# EasyEDA schematic 平衡车5.0.1.json

## Sheets
1 spin27: TITLE: Sheet_1; REV: 1.0; Date: 2022-07-06; Sheet: 1/1; Drawn By: Uchiha-Leslie; Company: Your Company
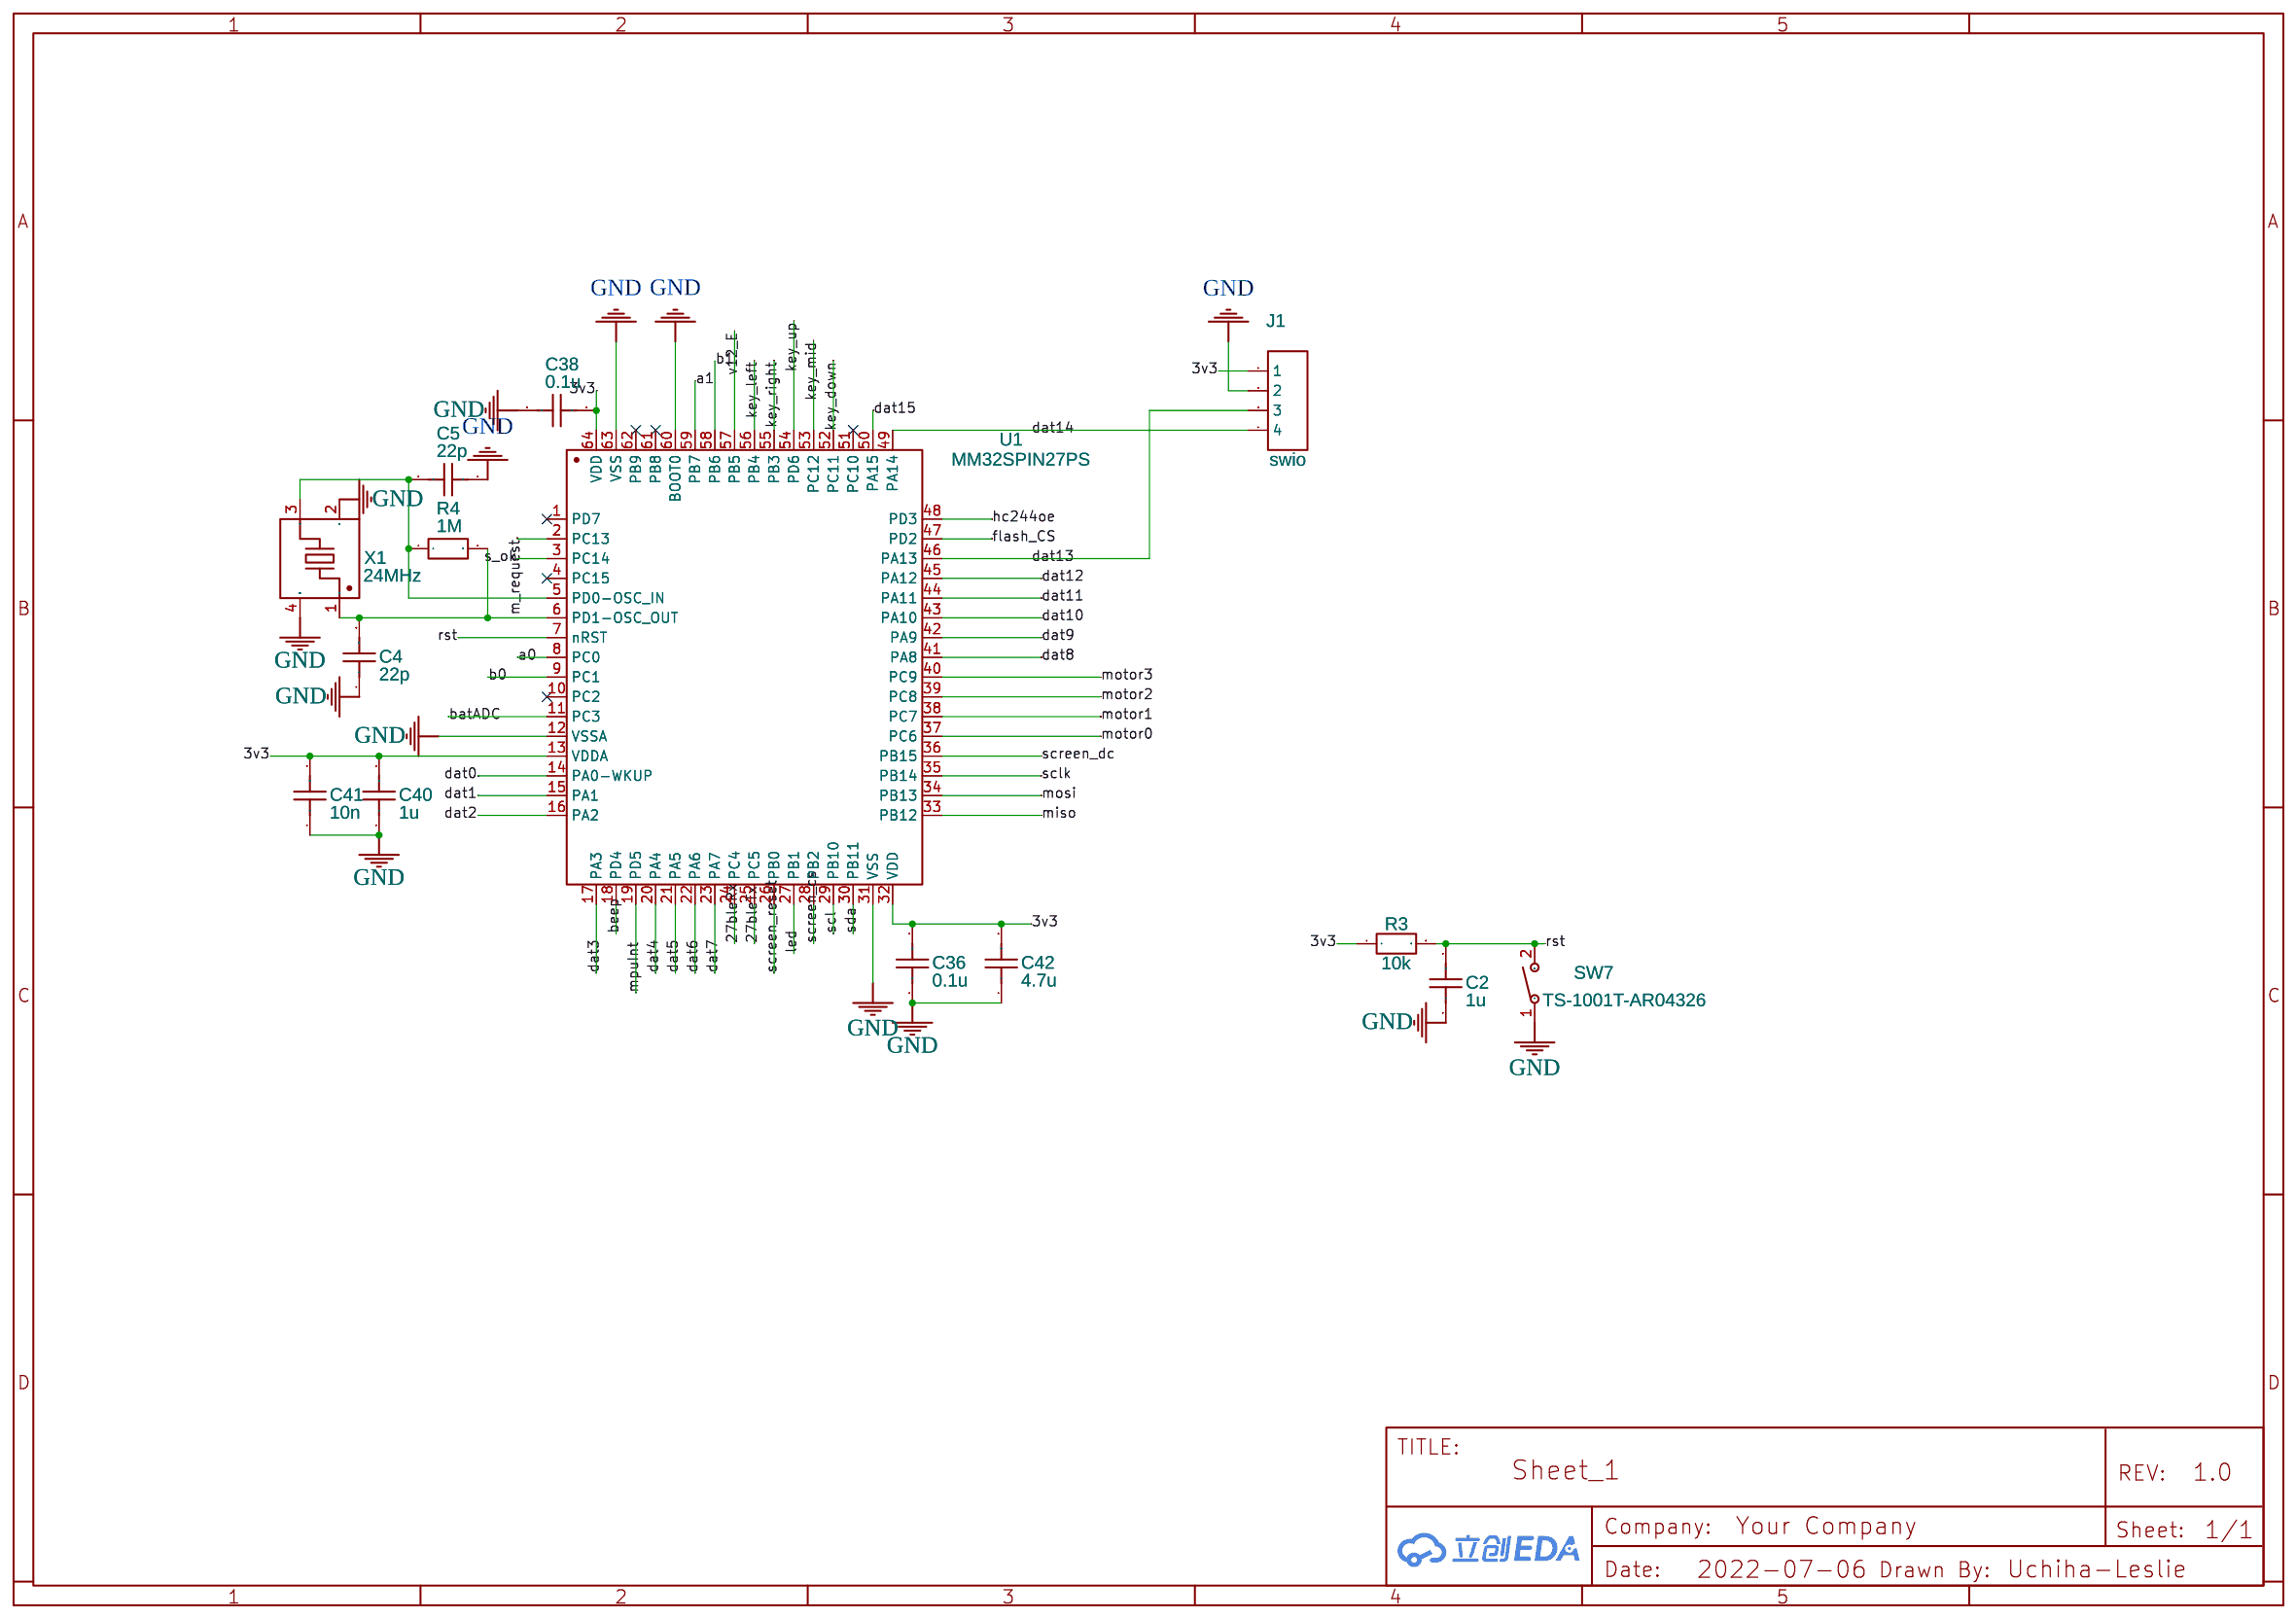
[diagram p0: spin27]
2 其他外设
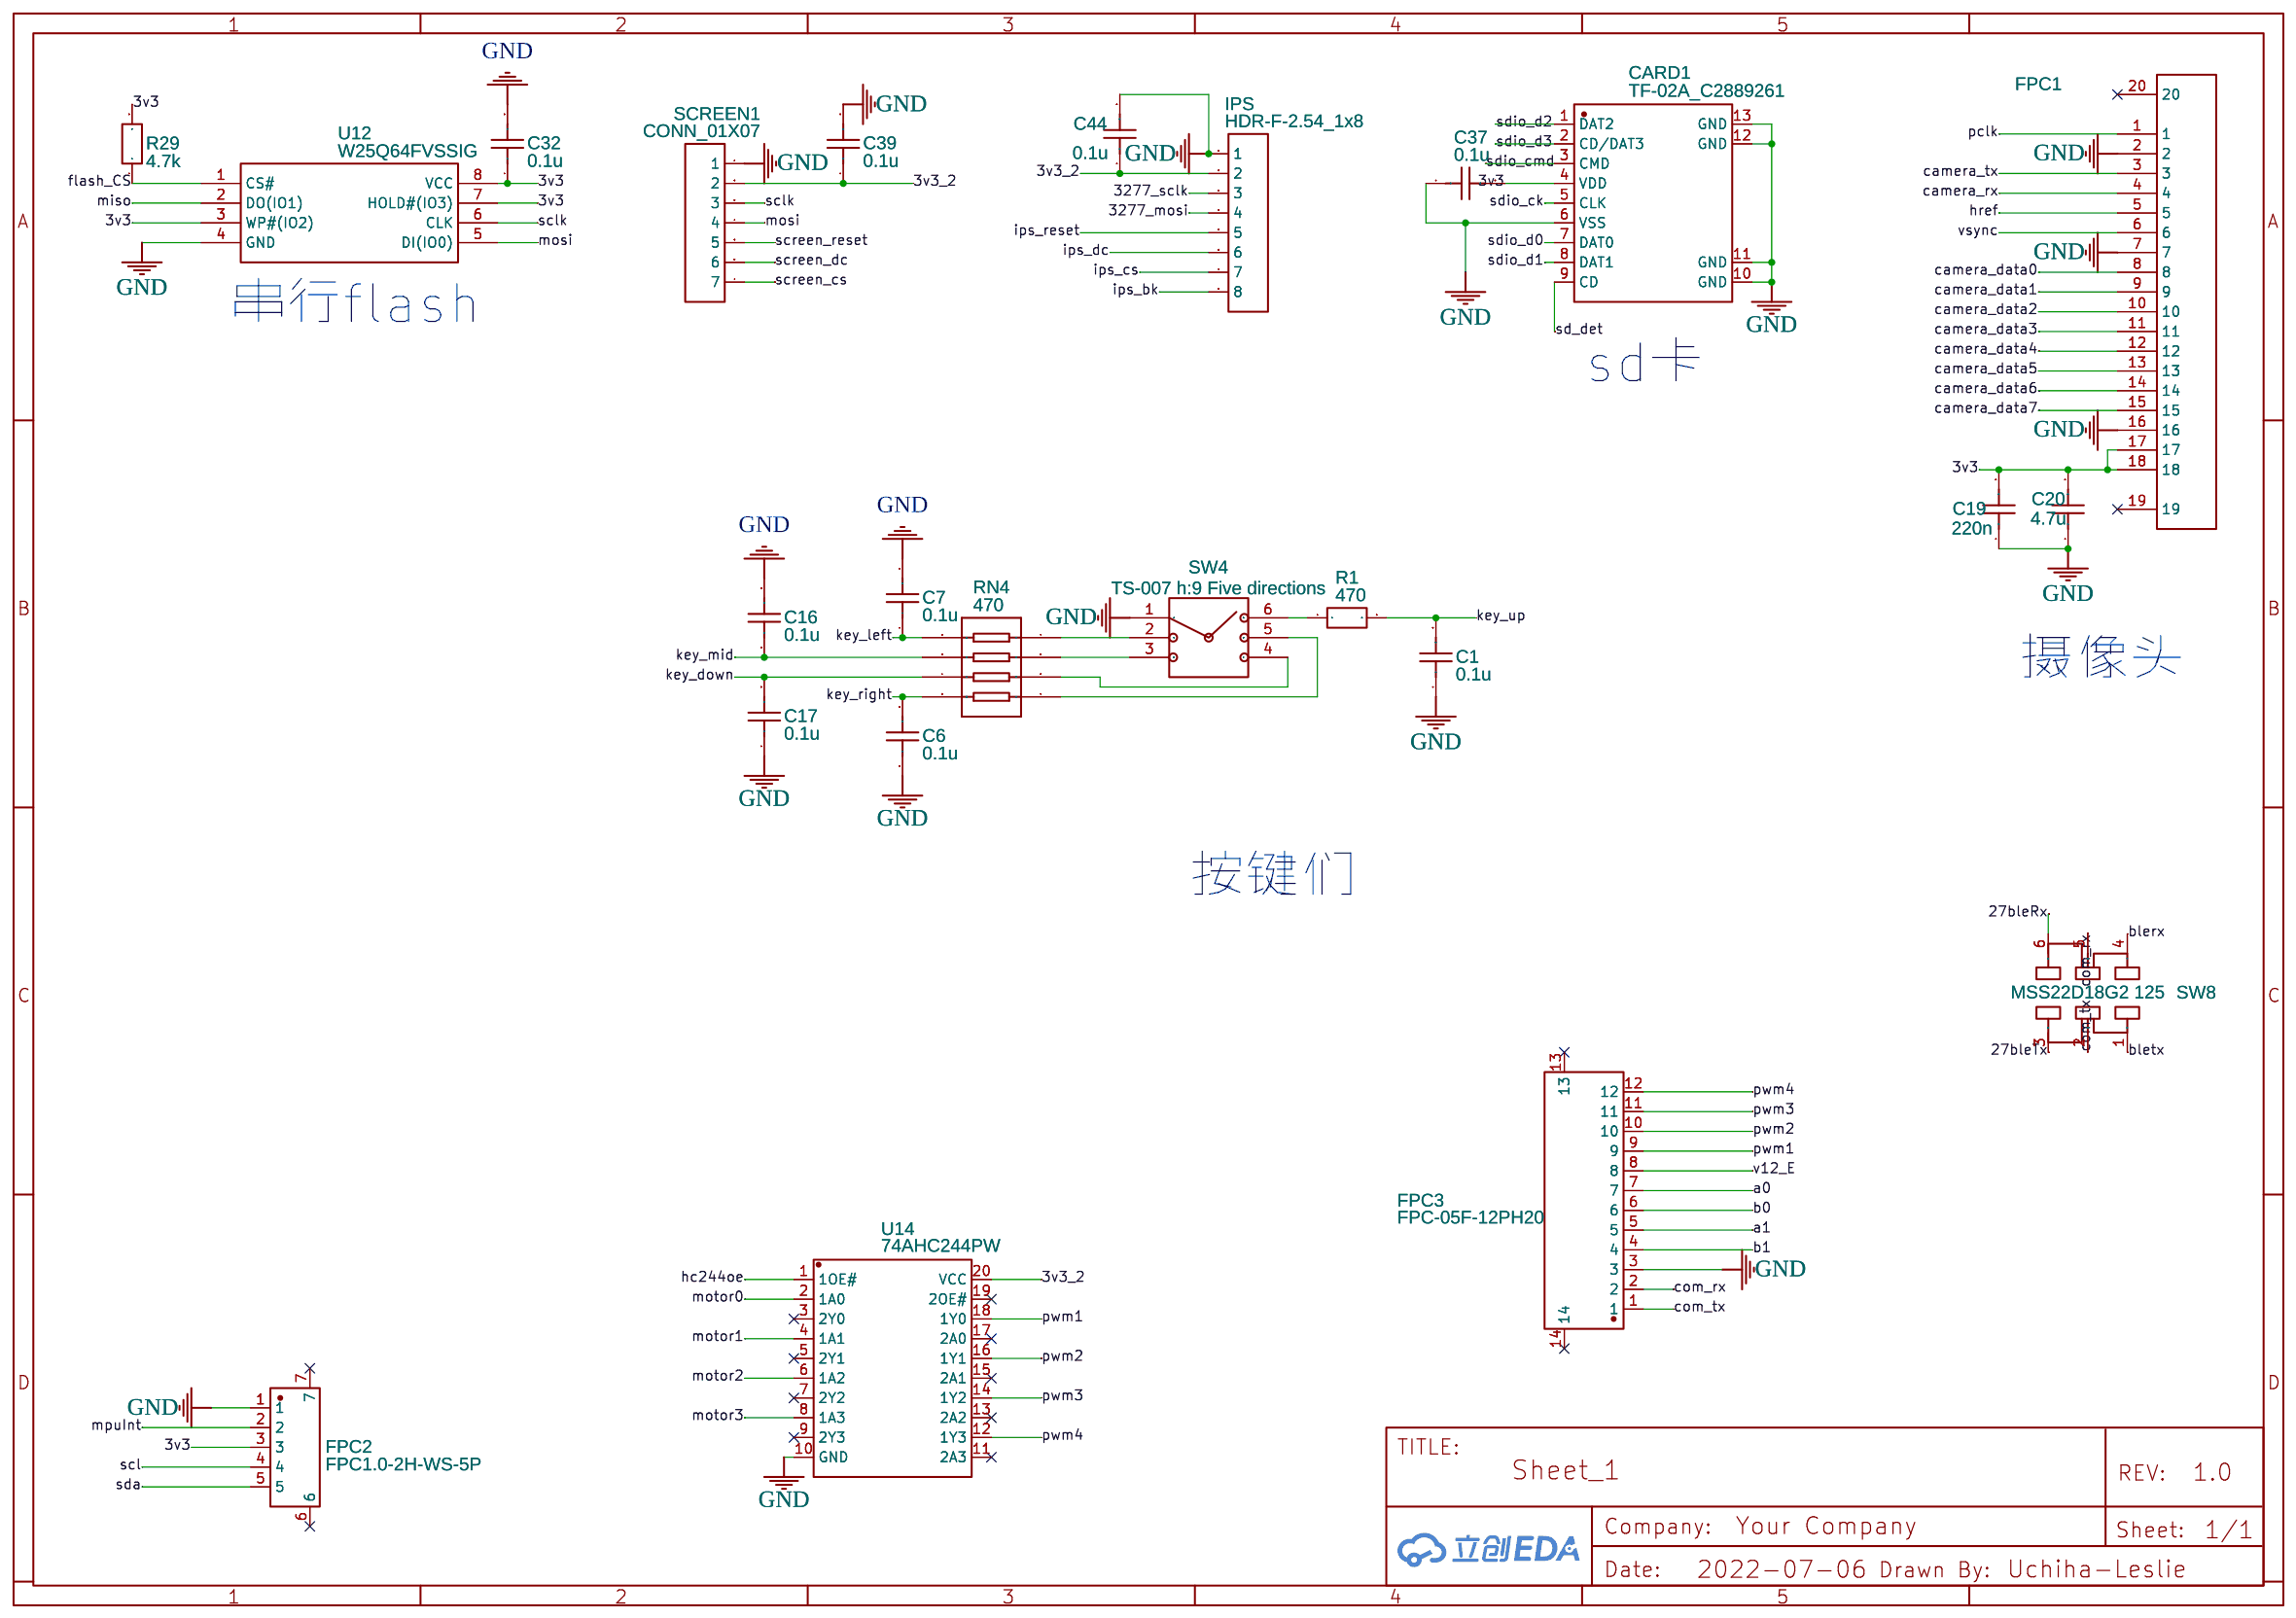
[diagram p1: 其他外设]
3 3277: TITLE: Sheet_2; Date: 2022-07-07
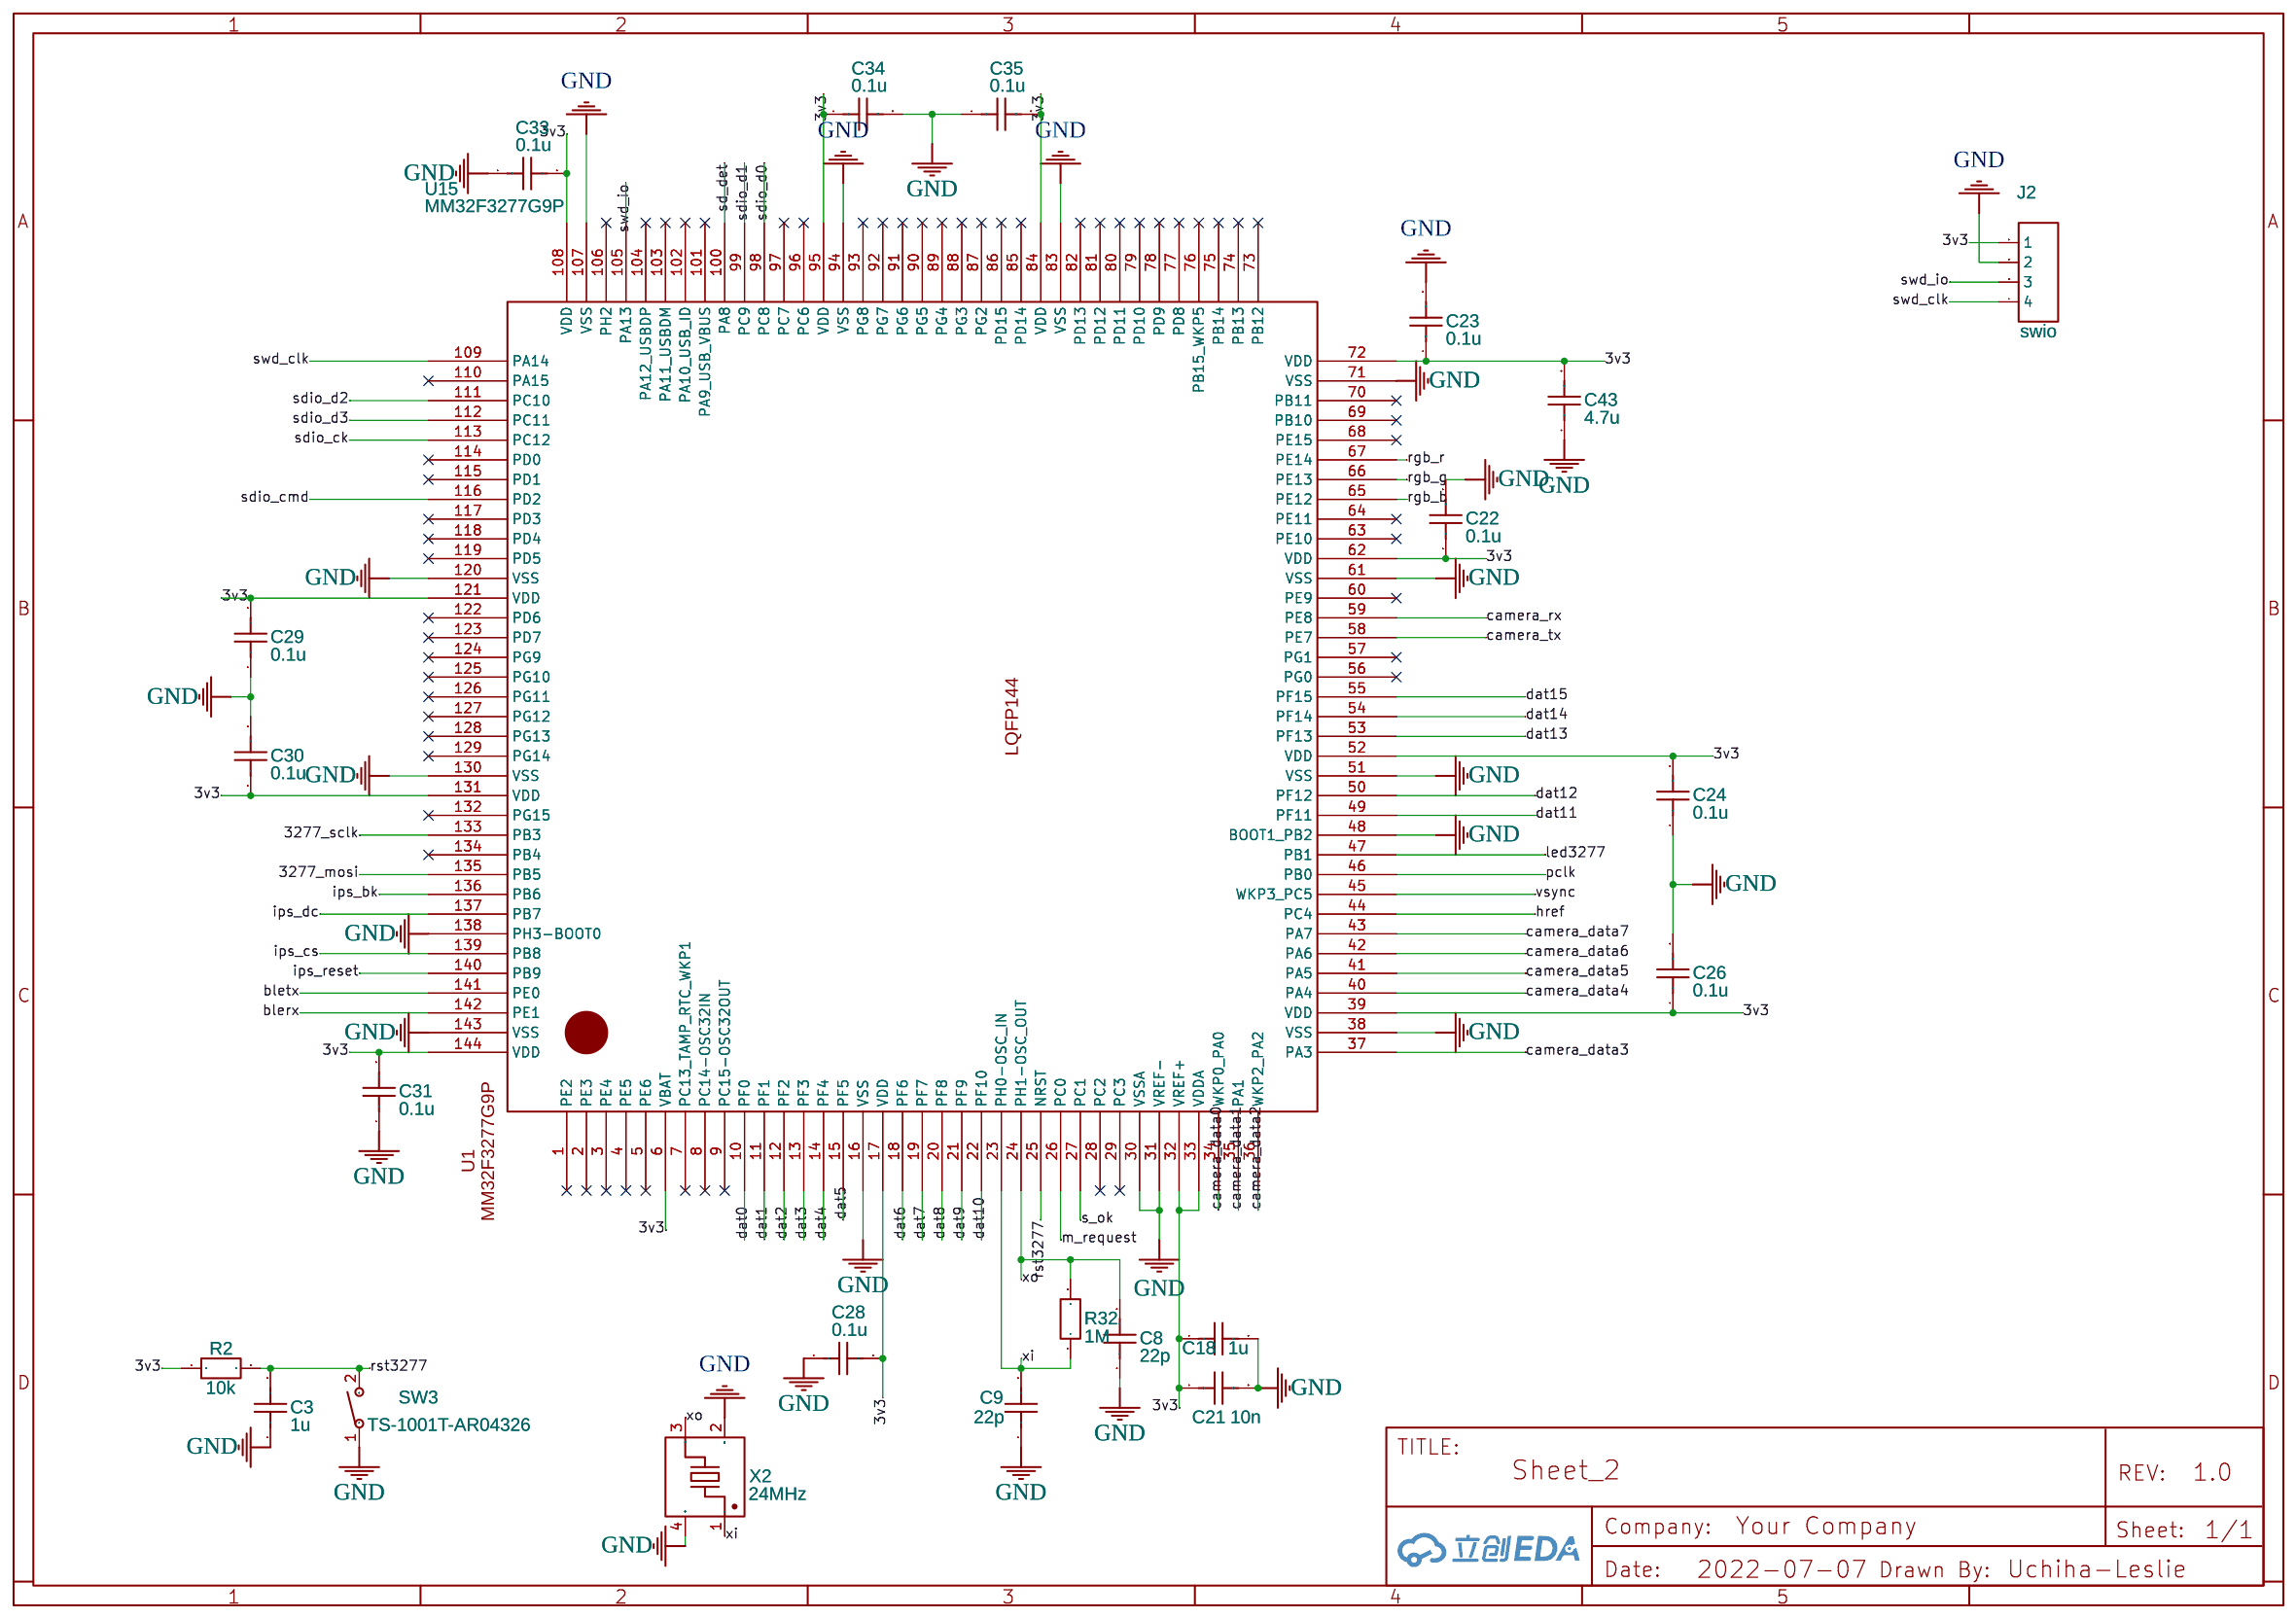
[diagram p2: 3277]
4 电源、稳压与测量: TITLE: Sheet_2; Date: 2022-07-29
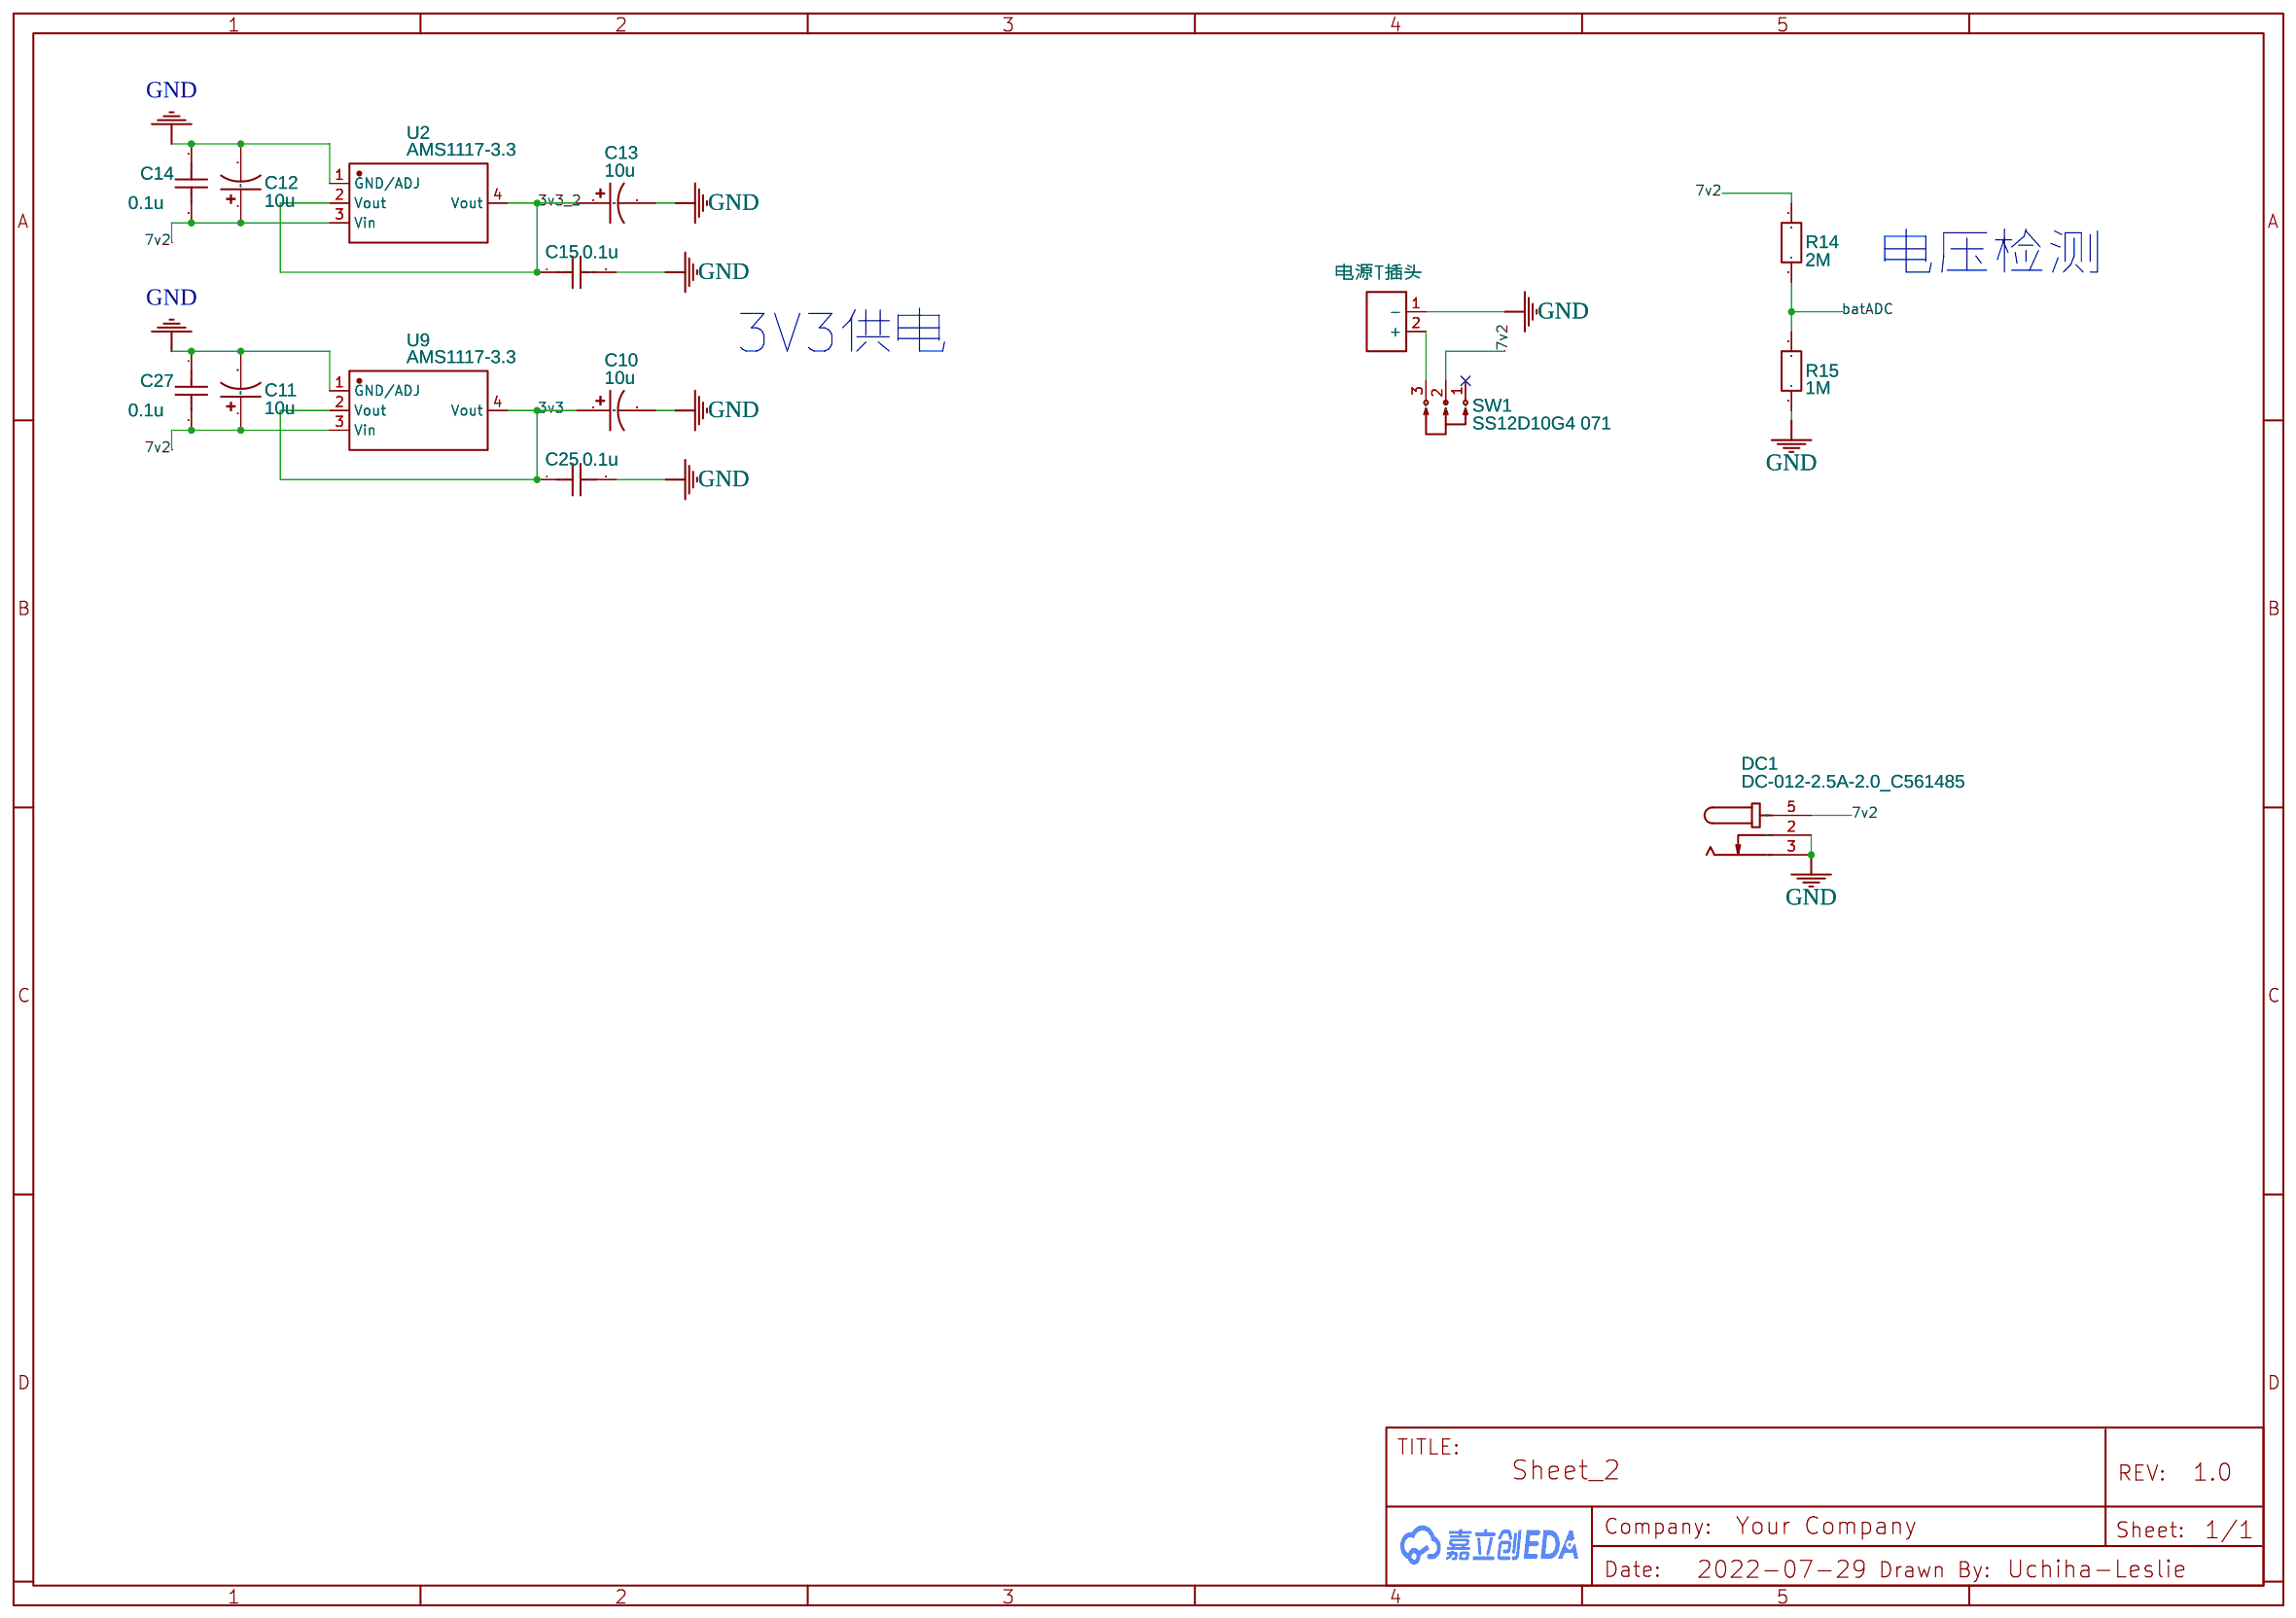
[diagram p3: 电源、稳压与测量]
5 蜂鸣器与LED: TITLE: Sheet_2; Date: 2022-07-29
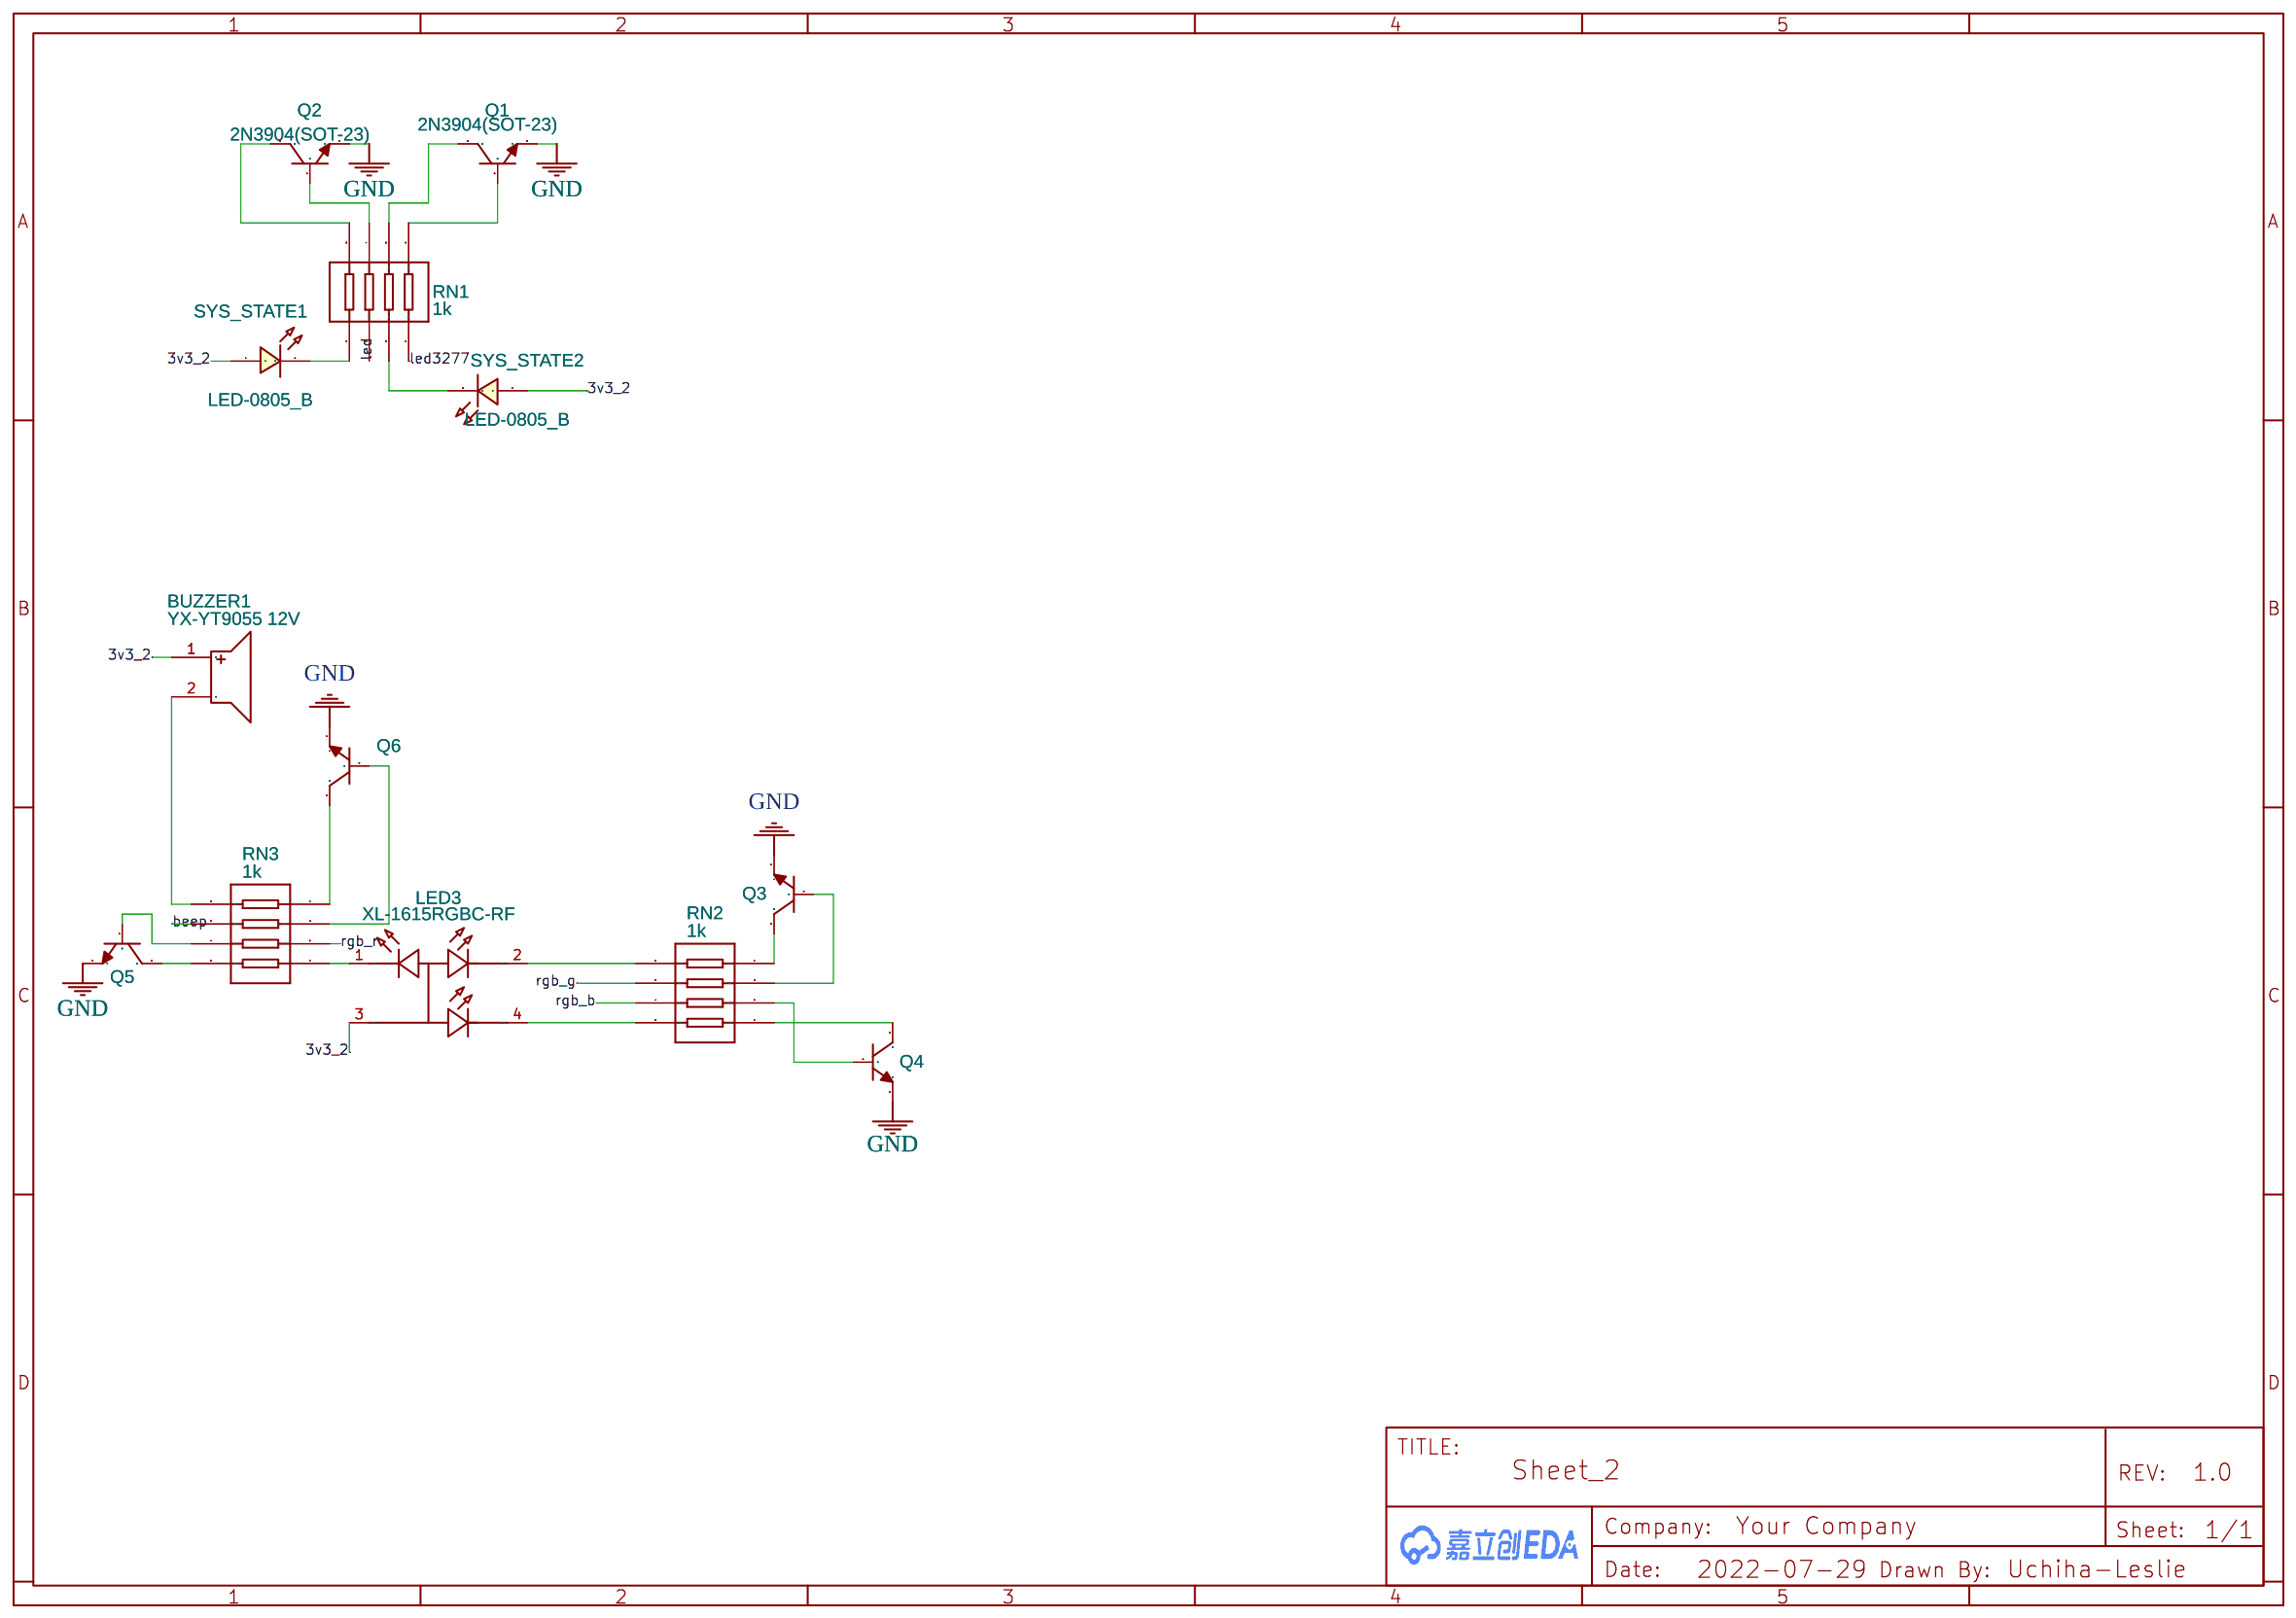
[diagram p4: 蜂鸣器与LED]

## Parts
sheet 3277
C3  1u  [C0603]
C8  22p  [C0603]
C9  22p  [C0603]
C18  1u  [C0603]
C21  10n  [C0603]
C22  0.1u  [C0402]
C23  0.1u  [C0402]
C24  0.1u  [C0402]
C26  0.1u  [C0402]
C28  0.1u  [C0402]
C29  0.1u  [C0402]
C30  0.1u  [C0402]
C31  0.1u  [C0402]
C33  0.1u  [C0402]
C34  0.1u  [C0402]
C35  0.1u  [C0402]
C43  4.7u  [C0603]
J2  swio  [HDR-M-2.54_1X4]
R2  10k  [R0603]
R32  1M  [R0603]
SW3  TS-1001T-AR04326  [KEY-SMD_L6.0-W3.5-LS8.0]
U15  MM32F3277G9P  [MM32F3277G9P]
X2  24MHz  [CRYSTAL-SMD_4P-L2.0-W1.6-BL-2]
sheet spin27
C2  1u  [C0603]
C4  22p  [C0603]
C5  22p  [C0603]
C36  0.1u  [C0402]
C38  0.1u  [C0402]
C40  1u  [C0603]
C41  10n  [C0603]
C42  4.7u  [C0603]
J1  swio  [HDR-M-2.54_1X4]
R3  10k  [R0603]
R4  1M  [R0603]
SW7  TS-1001T-AR04326  [KEY-SMD_L6.0-W3.5-LS8.0]
U1  MM32SPIN27PS  [LQFP-64_L10.0-W10.0-P0.50-LS12.0-BL]
X1  24MHz  [CRYSTAL-SMD_4P-L2.0-W1.6-BL-2]
sheet 其他外设
C1  0.1u  [C0402]
C6  0.1u  [C0402]
C7  0.1u  [C0402]
C16  0.1u  [C0402]
C17  0.1u  [C0402]
C19  220n  [C0603]
C20  4.7u  [C0603]
C32  0.1u  [C0402]
C37  0.1u  [C0402]
C39  0.1u  [C0402]
C44  0.1u  [C0402]
CARD1  TF-02A_C2889261  [TF-SMD_TF-02]
FPC1  F0500WR-S-18PNLNG1GB0R  [FPC-SMD_18P-P0.50_F0500WR-S-18PNLNG1GB0R]
FPC2  FPC1.0-2H-WS-5P  [FPC-SMD_5P-P1.00_FPC1.0-2H-WS-5P]
FPC3  FPC-05F-12PH20  [FPC-SMD_12P-P0.50_FPC-05F-12PH20]
IPS  HDR-F-2.54_1x8  [HDR-F-2.54_1X8]
R1  470  [R0603]
R29  4.7k  [R0603]
RN4  470  [RES-ARRAY-SMD_0603-8P-L3.2-W1.6-BL]
SCREEN1  CONN_01X07  [HDR-M-2.54_1X7]
SW4  TS-007 h:9 Five directions  [KEY-SMD_TS-007]
SW8  MSS22D18G2 125  [SW-TH_SHOU_MSS22D18G2]
U12  W25Q64FVSSIG  [SOP-8_L5.3-W5.2-P1.27-LS7.9-BL]
U14  74AHC244PW  [TSSOP-20_L6.5-W4.4-P0.65-LS6.4-BL]
sheet 电源、稳压与测量
C10  10u  [CASE-A_3216]
C11  10u  [CASE-A_3216]
C12  10u  [CASE-A_3216]
C13  10u  [CASE-A_3216]
C14  0.1u  [C0603]
C15  0.1u  [C0603]
C25  0.1u  [C0603]
C27  0.1u  [C0603]
DC1  DC-012-2.5A-2.0_C561485  [DC-IN-TH_DC-012B-2.5A-2.0]
H1  电源T插头  [电源T插口]
R14  2M  [R0603]
R15  1M  [R0603]
SW1  SS12D10G4 071  [SW-TH_SHOU-HAN_SS12D10G4]
U2  AMS1117-3.3  [SOT-223-3_L6.5-W3.4-P2.30-LS7.0-BR]
U9  AMS1117-3.3  [SOT-223-3_L6.5-W3.4-P2.30-LS7.0-BR]
sheet 蜂鸣器与LED
BUZZER1  YX-YT9055 12V  [BUZ-TH_BD9.0-P5.00-D0.6-FD]
LED3  XL-1615RGBC-RF  [LED-SMD_4P-L1.6-W1.5-TL-A]
Q1  2N3904(SOT-23)  [SOT-23-3_L2.9-W1.3-P1.90-LS2.4-TR]
Q2  2N3904(SOT-23)  [SOT-23-3_L2.9-W1.3-P1.90-LS2.4-TR]
Q3  2N3904(SOT-23)  [SOT-23-3_L2.9-W1.3-P1.90-LS2.4-TR]
Q4  2N3904(SOT-23)  [SOT-23-3_L2.9-W1.3-P1.90-LS2.4-TR]
Q5  2N3904(SOT-23)  [SOT-23-3_L2.9-W1.3-P1.90-LS2.4-TR]
Q6  2N3904(SOT-23)  [SOT-23-3_L2.9-W1.3-P1.90-LS2.4-TR]
RN1  1k  [RES-ARRAY-SMD_0603-8P-L3.2-W1.6-BL]
RN2  1k  [RES-ARRAY-SMD_0603-8P-L3.2-W1.6-BL]
RN3  1k  [RES-ARRAY-SMD_0603-8P-L3.2-W1.6-BL]
SYS_STATE1  LED-0805_B  [LED0805_BLUE]
SYS_STATE2  LED-0805_B  [LED0805_BLUE]

## Library data of the parts
C2-C5 C8 C9 C14 C15 C18-C21 C25 C27 C40-C43 = C_0603_US: Contributor: LCEDA_Lib
C1 C6 C7 C16 C17 C22-C24 C26 C28-C39 C44 = C_0402_US: Contributor: LCEDA_Lib
J1 J2 = HDR-M-2.54_1x4: Supplier Part: C124378; Supplier: LCSC; Contributor: LCEDA_Lib
R1-R4 R14 R15 R29 R32 = R_0603_EU: Contributor: LCEDA_Lib
SW3 SW7 = TS-1001T-AR04326: Supplier: LCSC; Supplier Part: C920203; Manufacturer: XUNPU(讯普); Contributor: LCSC; JLCPCB Part Class: Extended Part
U15 = MM32F3277G9P
X1 X2 = CN4024M00012T8188012: Supplier: LCSC; Supplier Part: C708987; Manufacturer: JWT; Contributor: LCSC; JLCPCB Part Class: Extended Part
U1 = MM32SPIN27PS: Supplier: LCSC; Supplier Part: C2908053; Manufacturer: null; Manufacturer Part: mm32spin27ps; JLCPCB Part Class: Extended Part; Contributor: LCSC
CARD1 = TF-02A_C2889261: Supplier: LCSC; Supplier Part: C2889261; Manufacturer: Yuandi(台湾元迪); Manufacturer Part: TF-02A; Contributor: LCSC; JLCPCB Part Class: Extended Part
FPC1 = F0500WR-S-18PNLNG1GB0R: Supplier: LCSC; Supplier Part: C247896; Manufacturer: Joint Tech Elec; Contributor: LCSC; JLCPCB Part Class: Extended Part
FPC2 = FPC1.0-2H-WS-5P: Supplier: LCSC; Supplier Part: C9900003417; Manufacturer: null; Contributor: LCSC; JLCPCB Part Class: Extended Part
FPC3 = FPC-05F-12PH20: Supplier: LCSC; Supplier Part: C2856799; Manufacturer: XUNPU(讯普); Contributor: LCSC; JLCPCB Part Class: Extended Part
IPS = HDR-F-2.54_1x8: Supplier Part: C225505; Supplier: LCSC; Contributor: LCEDA_Lib
RN1-RN4 = YC164-JR-070RL: Supplier: LCSC; Supplier Part: C327053; Manufacturer: YAGEO; Contributor: LCSC; JLCPCB Part Class: Extended Part; Resistance: 0Ω
SCREEN1 = CONN_01X07: Contributor: KiCAD
SW4 = TS-007 h:9 Five directions: Supplier Part: C3679; Supplier: LCSC; Manufacturer: ReliaPro
SW8 = MSS22D18G2 125: Supplier: LCSC; Supplier Part: C2906278; Manufacturer: SHOU HAN(首韩); Contributor: LCSC
U12 = W25Q64FVSSIG: Supplier: LCSC; Manufacturer: WINBOND; Supplier Part: C14067; JLCPCB Part Class: Extended Part
U14 = 74AHC244PW: Supplier: LCSC; Manufacturer: PHILIPS; Supplier Part: C5515; JLCPCB Part Class: Extended Part
C10-C13 = C_Tan_SMD_A_US: Contributor: LCEDA_Lib
DC1 = DC-012-2.5A-2.0_C561485: Supplier: LCSC; Supplier Part: C561485; Manufacturer: XKB Connectivity(中国星坤); Manufacturer Part: DC-012-2.5A-2.0; Contributor: lcsc
H1 = 电源T插头: Manufacturer: TE Connectivity; Manufacturer Part: 3-644456-2; Supplier Part: C90288; Contributor: JiaMinghui
SW1 = SS12D10G4 071: Supplier: LCSC; Supplier Part: C2887259; Manufacturer: SHOU HAN(首韩); Contributor: LCSC; JLCPCB Part Class: Extended Part
U2 U9 = AMS1117-3.3: sourceId: dwIGgezVh; Supplier: LCSC; Manufacturer: AMS; Supplier Part: C6186; JLCPCB Part Class: Basic Part
BUZZER1 = YX-YT9055 12V: Supplier: LCSC; Supplier Part: C781852; Manufacturer: YUEXIN; Contributor: LCSC; JLCPCB Part Class: Extended Part
LED3 = XL-1615RGBC-RF: Supplier: LCSC; Supplier Part: C965840; Manufacturer: XINGLIGHT(成兴光); JLCPCB Part Class: Extended Part; Contributor: LCSC
Q1-Q6 = 2N3904(SOT-23): Supplier: LCSC; Manufacturer: KEC; Manufacturer Part: 2n3904S-RTK/PS; Supplier Part: C18536; Paste Type: SOT-23; Contributor: LCEDA_Lib
SYS_STATE1 SYS_STATE2 = LED-0805_B: Manufacturer: 方舟 ARKLED; Manufacturer Part: D-B080508B1-KS2; Supplier Part: C108412; Contributor: LCEDA_Lib

## Nets
3v3: C10.1 C18.1 C19.2 C20.2 C21.1 C22.1 C23.1 C24.2 C25.1 C26.1 C28.2 C29.2 C30.1 C31.2 C32.1 C33.2 C34.1 C35.2 C36.2 C37.2 C38.2 C40.2 C41.2 C42.2 C43.2 CARD1.4(VDD) FPC1.17 FPC1.18 FPC2.3 J1.1 J2.1 R2.1 R3.1 R29.2 U1.13(VDDA) U1.32(VDD) U1.64(VDD) U9.2(Vout) U9.4(Vout) U12.3(WP#(IO2)) U12.7(HOLD#(IO3)) U12.8(VCC) U15.6(VBAT) U15.17(VDD) U15.32(VREF+) U15.33(VDDA) U15.39(VDD) U15.52(VDD) U15.62(VDD) U15.72(VDD) U15.84(VDD) U15.95(VDD) U15.108(VDD) U15.121(VDD) U15.131(VDD) U15.144(VDD)
3v3_2: BUZZER1.1 C13.1 C15.1 C39.1 C44.1 IPS.2 LED3.3(COM+) SCREEN1.2 SYS_STATE1.1 SYS_STATE2.1 U2.2(Vout) U2.4(Vout) U14.20(VCC)
7v2: C11.1 C12.1 C14.2 C27.2 DC1.5 R14.2 SW1.2 U2.3(Vin) U9.3(Vin)
GND: C1.1 C2.1 C3.1 C4.1 C5.1 C6.1 C7.2 C8.1 C9.1 C10.2 C11.2 C12.2 C13.2 C14.1 C15.2 C16.2 C17.1 C18.2 C19.1 C20.1 C21.2 C22.2 C23.2 C24.1 C25.2 C26.2 C27.1 C28.1 C29.1 C30.2 C31.1 C32.2 C33.1 C34.2 C35.1 C36.1 C37.1 C38.1 C39.2 C40.1 C41.1 C42.1 C43.1 C44.2 CARD1.6(VSS) CARD1.10(GND) CARD1.11(GND) CARD1.12(GND) CARD1.13(GND) DC1.2 DC1.3 FPC1.2 FPC1.7 FPC1.16 FPC2.1 FPC3.3 H1.1(-) IPS.1 J1.2 J2.2 Q1.1(E) Q2.1(E) Q3.1(E) Q4.1(E) Q5.1(E) Q6.1(E) R15.1 SCREEN1.1 SW3.1 SW4.1 SW7.1 U1.12(VSSA) U1.31(VSS) U1.60(BOOT0) U1.63(VSS) U2.1(GND/ADJ) U9.1(GND/ADJ) U12.4(GND) U14.10(GND) U15.16(VSS) U15.30(VSSA) U15.31(VREF-) U15.38(VSS) U15.48(BOOT1_PB2) U15.51(VSS) U15.61(VSS) U15.71(VSS) U15.83(VSS) U15.94(VSS) U15.107(VSS) U15.120(VSS) U15.130(VSS) U15.138(PH3-BOOT0) U15.143(VSS) X1.2(GND) X1.4(GND) X2.2(GND) X2.4(GND)
v12_E: FPC3.8 U1.57(PB5)
27bleRx: SW8.6 U1.24(PC4)
27bleTx: SW8.3 U1.25(PC5)
3277_mosi: IPS.4 U15.135(PB5)
3277_sclk: IPS.3 U15.133(PB3)
a0: FPC3.7 U1.8(PC0)
a1: FPC3.5 U1.59(PB7)
b0: FPC3.6 U1.9(PC1)
b1: FPC3.4 U1.58(PB6)
batADC: R14.1 R15.2 U1.11(PC3)
beep: RN3.6 U1.18(PD4)
blerx: SW8.4 U15.142(PE1)
bletx: SW8.1 U15.141(PE0)
camera_data0: FPC1.8 U15.34(WKP0_PA0)
camera_data1: FPC1.9 U15.35(PA1)
camera_data2: FPC1.10 U15.36(WKP2_PA2)
camera_data3: FPC1.11 U15.37(PA3)
camera_data4: FPC1.12 U15.40(PA4)
camera_data5: FPC1.13 U15.41(PA5)
camera_data6: FPC1.14 U15.42(PA6)
camera_data7: FPC1.15 U15.43(PA7)
camera_rx: FPC1.4 U15.59(PE8)
camera_tx: FPC1.3 U15.58(PE7)
com_rx: FPC3.2 SW8.5
com_tx: FPC3.1 SW8.2
dat0: U1.14(PA0-WKUP) U15.10(PF0)
dat1: U1.15(PA1) U15.11(PF1)
dat2: U1.16(PA2) U15.12(PF2)
dat3: U1.17(PA3) U15.13(PF3)
dat4: U1.20(PA4) U15.14(PF4)
dat5: U1.21(PA5) U15.15(PF5)
dat6: U1.22(PA6) U15.18(PF6)
dat7: U1.23(PA7) U15.19(PF7)
dat8: U1.41(PA8) U15.20(PF8)
dat9: U1.42(PA9) U15.21(PF9)
dat10: U1.43(PA10) U15.22(PF10)
dat11: U1.44(PA11) U15.49(PF11)
dat12: U1.45(PA12) U15.50(PF12)
dat13: J1.3 U1.46(PA13) U15.53(PF13)
dat14: J1.4 U1.49(PA14) U15.54(PF14)
dat15: U1.50(PA15) U15.55(PF15)
flash_CS: R29.1 U1.47(PD2) U12.1(CS#)
hc244oe: U1.48(PD3) U14.1(1OE#)
href: FPC1.5 U15.44(PC4)
ips_bk: IPS.8 U15.136(PB6)
ips_cs: IPS.7 U15.139(PB8)
ips_dc: IPS.6 U15.137(PB7)
ips_reset: IPS.5 U15.140(PB9)
key_down: C17.2 RN4.7 U1.52(PC11)
key_left: C7.1 RN4.5 U1.56(PB4)
key_mid: C16.1 RN4.6 U1.53(PC12)
key_right: C6.2 RN4.8 U1.55(PB3)
key_up: C1.2 R1.2 U1.54(PD6)
led: RN1.2 U1.27(PB1)
led3277: RN1.4 U15.47(PB1)
m_request: U1.2(PC13) U15.26(PC0)
miso: U1.33(PB12) U12.2(DO(IO1))
mosi: SCREEN1.4 U1.34(PB13) U12.5(DI(IO0))
motor0: U1.37(PC6) U14.2(1A0)
motor1: U1.38(PC7) U14.4(1A1)
motor2: U1.39(PC8) U14.6(1A2)
motor3: U1.40(PC9) U14.8(1A3)
mpuInt: FPC2.2 U1.19(PD5)
pclk: FPC1.1 U15.46(PB0)
pwm1: FPC3.9 U14.18(1Y0)
pwm2: FPC3.10 U14.16(1Y1)
pwm3: FPC3.11 U14.14(1Y2)
pwm4: FPC3.12 U14.12(1Y3)
rgb_b: RN2.7 U15.65(PE12)
rgb_g: RN2.6 U15.66(PE13)
rgb_r: RN3.2 U15.67(PE14)
rst: C2.2 R3.2 SW7.2 U1.7(nRST)
rst3277: C3.2 R2.2 SW3.2 U15.25(NRST)
s_ok: U1.3(PC14) U15.27(PC1)
scl: FPC2.4 U1.29(PB10)
sclk: SCREEN1.3 U1.35(PB14) U12.6(CLK)
screen_cs: SCREEN1.7 U1.28(PB2)
screen_dc: SCREEN1.6 U1.36(PB15)
screen_reset: SCREEN1.5 U1.26(PB0)
sd_det: CARD1.9(CD) U15.100(PA8)
sda: FPC2.5 U1.30(PB11)
sdio_ck: CARD1.5(CLK) U15.113(PC12)
sdio_cmd: CARD1.3(CMD) U15.116(PD2)
sdio_d0: CARD1.7(DAT0) U15.98(PC8)
sdio_d1: CARD1.8(DAT1) U15.99(PC9)
sdio_d2: CARD1.1(DAT2) U15.111(PC10)
sdio_d3: CARD1.2(CD/DAT3) U15.112(PC11)
swd_clk: J2.4 U15.109(PA14)
swd_io: J2.3 U15.105(PA13)
vsync: FPC1.6 U15.45(WKP3_PC5)
xi: C9.2 R32.1 U15.23(PH0-OSC_IN) X2.1
xo: C8.2 R32.2 U15.24(PH1-OSC_OUT) X2.3
Net-(BUZZER1-2): BUZZER1.2 RN3.5
Net-(C4-2): C4.2 R4.2 U1.6(PD1-OSC_OUT) X1.1
Net-(C5-2): C5.2 R4.1 U1.5(PD0-OSC_IN) X1.3
Net-(H1-2): H1.2(+) SW1.3
Net-(LED3-1): LED3.1(R-) RN3.1
Net-(LED3-2): LED3.2(G-) RN2.5
Net-(LED3-4): LED3.4(B-) RN2.8
Net-(Q1-2): Q1.2(B) RN1.5
Net-(Q1-3): Q1.3(C) RN1.6
Net-(Q2-2): Q2.2(B) RN1.7
Net-(Q2-3): Q2.3(C) RN1.8
Net-(Q3-2): Q3.2(B) RN2.3
Net-(Q3-3): Q3.3(C) RN2.4
Net-(Q4-2): Q4.2(B) RN2.2
Net-(Q4-3): Q4.3(C) RN2.1
Net-(Q5-2): Q5.2(B) RN3.7
Net-(Q5-3): Q5.3(C) RN3.8
Net-(Q6-2): Q6.2(B) RN3.3
Net-(Q6-3): Q6.3(C) RN3.4
Net-(R1-1): R1.1 SW4.6
Net-(RN1-1): RN1.1 SYS_STATE1.2
Net-(RN1-3): RN1.3 SYS_STATE2.2
Net-(RN4-1): RN4.1 SW4.5
Net-(RN4-2): RN4.2 SW4.4
Net-(RN4-3): RN4.3 SW4.3
Net-(RN4-4): RN4.4 SW4.2

Not connected (* = marked no-connect by the designer): FPC1 19* 20*; FPC2 6* 7*; FPC3 13* 14*; SW1 1*; U1 1(PD7)* 4(PC15)* 10(PC2)* 51(PC10)* 61(PB8)* 62(PB9)*; U14 3(2Y0)* 5(2Y1)* 7(2Y2)* 9(2Y3)* 11(2A3)* 13(2A2)* 15(2A1)* 17(2A0)* 19(2OE#)*; U15 1(PE2)* 2(PE3)* 3(PE4)* 4(PE5)* 5(PE6)* 7(PC13_TAMP_RTC_WKP1)* 8(PC14-OSC32IN)* 9(PC15-OSC32OUT)* 28(PC2)* 29(PC3)* 56(PG0)* 57(PG1)* 60(PE9)* 63(PE10)* 64(PE11)* 68(PE15)* 69(PB10)* 70(PB11)* 73(PB12)* 74(PB13)* 75(PB14)* 76(PB15_WKP5)* 77(PD8)* 78(PD9)* 79(PD10)* 80(PD11)* 81(PD12)* 82(PD13)* 85(PD14)* 86(PD15)* 87(PG2)* 88(PG3)* 89(PG4)* 90(PG5)* 91(PG6)* 92(PG7)* 93(PG8)* 96(PC6)* 97(PC7)* 101(PA9_USB_VBUS)* 102(PA10_USB_ID)* 103(PA11_USBDM)* 104(PA12_USBDP)* 106(PH2)* 110(PA15)* 114(PD0)* 115(PD1)* 117(PD3)* 118(PD4)* 119(PD5)* 122(PD6)* 123(PD7)* 124(PG9)* 125(PG10)* 126(PG11)* 127(PG12)* 128(PG13)* 129(PG14)* 132(PG15)* 134(PB4)*

## Notes on the sheets
sheet 2
- 串行flash
- sd卡
- 摄像头
- 按键们
sheet 4
- 电压检测
- 3V3供电
